# EAGLE design giraffe-cjd (EAGLE 9.1.0)
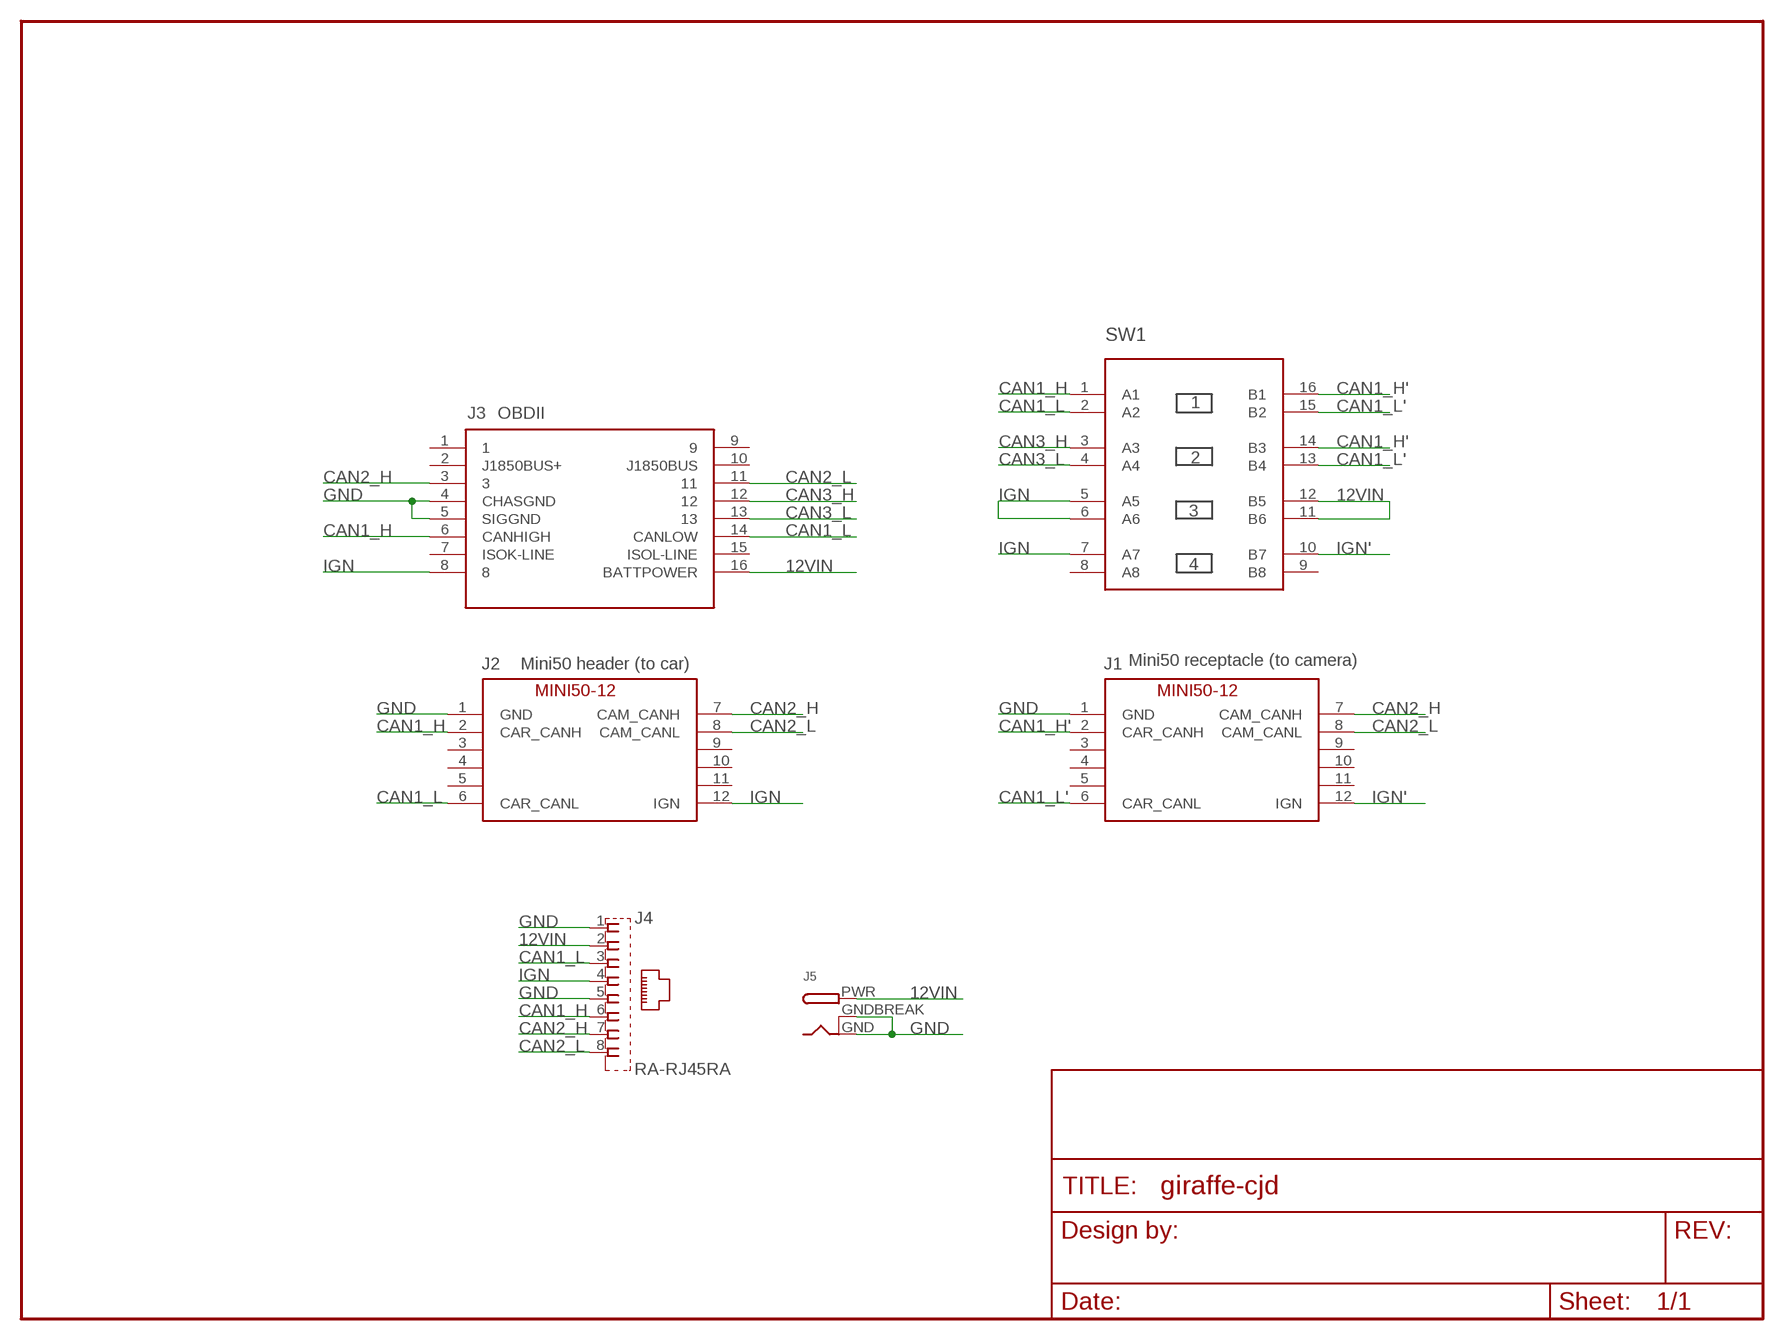
[diagram p0: schematic, sheet 1]

## Parts
FRAME1  FRAME-LETTERNO_PACKAGE  [DUMMY]
J1  MINI50MINI50-12-VERT  [MINI50-12]
J2  MINI50MINI50-12-VERT  [MINI50-12]
J3  OBDII-FEMALE-CUT  [OBDII-FEMALE-MIDCUT]
J4  RA-RJ45RA  [RA-RJ45]
J5  DCBARRELPTH  [DCJACK_2MM_PTH]
SW1  4XDPSTSMT  [4-DPST]

## Nets
12VIN: J3.16(BATTPOWER) J4.2 J5.PWR SW1.11(B6) SW1.12(B5)
CAN1_H: J2.2(CAR_CANH) J3.6(CANHIGH) J4.6 SW1.1(A1)
CAN1_H': J1.2(CAR_CANH) SW1.14(B3) SW1.16(B1)
CAN1_L: J2.6(CAR_CANL) J3.14(CANLOW) J4.3 SW1.2(A2)
CAN1_L': J1.6(CAR_CANL) SW1.13(B4) SW1.15(B2)
CAN2_H: J1.7(CAM_CANH) J2.7(CAM_CANH) J3.3 J4.7
CAN2_L: J1.8(CAM_CANL) J2.8(CAM_CANL) J3.11 J4.8
CAN3_H: J3.12 SW1.3(A3)
CAN3_L: J3.13 SW1.4(A4)
GND: J1.1(GND) J2.1(GND) J3.4(CHASGND) J3.5(SIGGND) J4.1 J4.5 J5.GND J5.GNDBREAK
IGN: J2.12(IGN) J3.8 J4.4 SW1.5(A5) SW1.6(A6) SW1.7(A7)
IGN': J1.12(IGN) SW1.10(B7)
Unconnected: J1.3 J1.4 J1.5 J1.9 J1.10 J1.11 J2.3 J2.4 J2.5 J2.9 J2.10 J2.11 J3.1 J3.2(J1850BUS+) J3.7(ISOK-LINE) J3.9 J3.10(J1850BUS) J3.15(ISOL-LINE) SW1.8(A8) SW1.9(B8)

## Notes on the sheet
- OBDII
- Mini50 header (to car) | Mini50 receptacle (to camera)

## Library data of the parts
FRAME1 = SparkFun-Aesthetics:FRAME-LETTER: Schematic Frame Standard 8.5x11 US Letter frame; DESIGNER: adhintz; VERSION: v01
J1 J2 = comma2.ai:MINI50: mini50 12 vertical header
J3 = comma.ai:OBDII-FEMALE
J4 = comma.ai:RA-RJ45
J5 = adafruit:DCBARREL: 2.0mm DC Barrel Jack DCJACK_2MM_PTH - Through Hole Jack (4UConnector: 05537)
SW1 = comma.ai:4XDPST

## Board
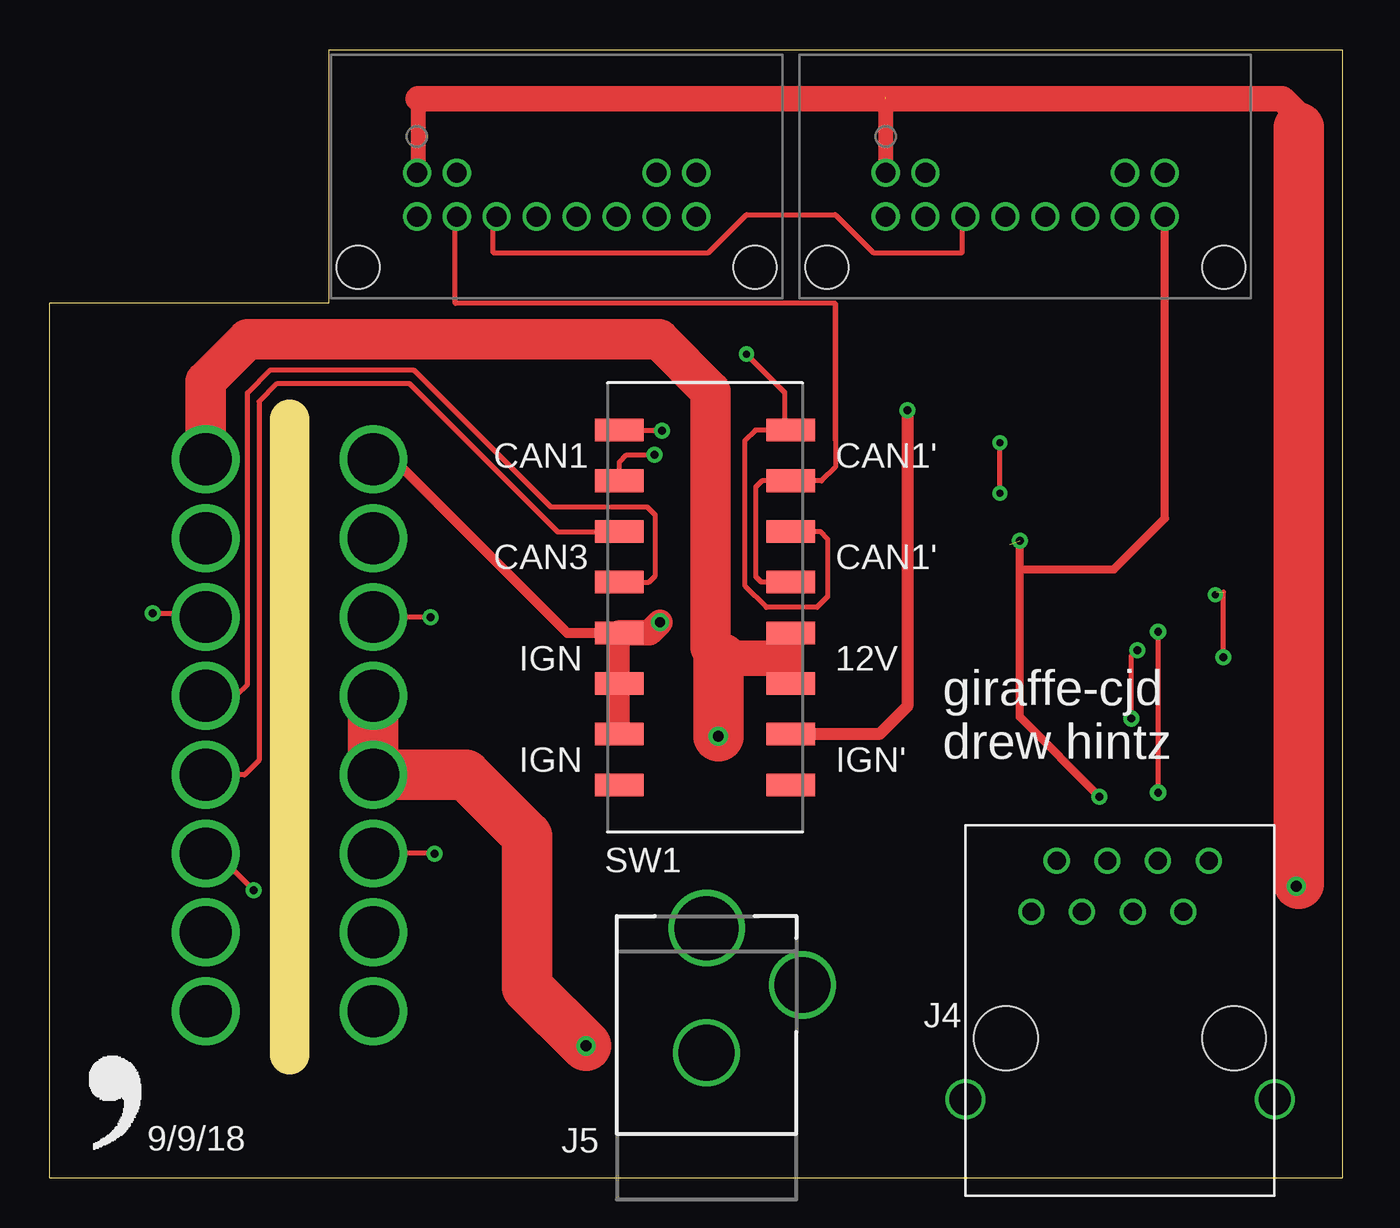
[diagram p1: board, top side]
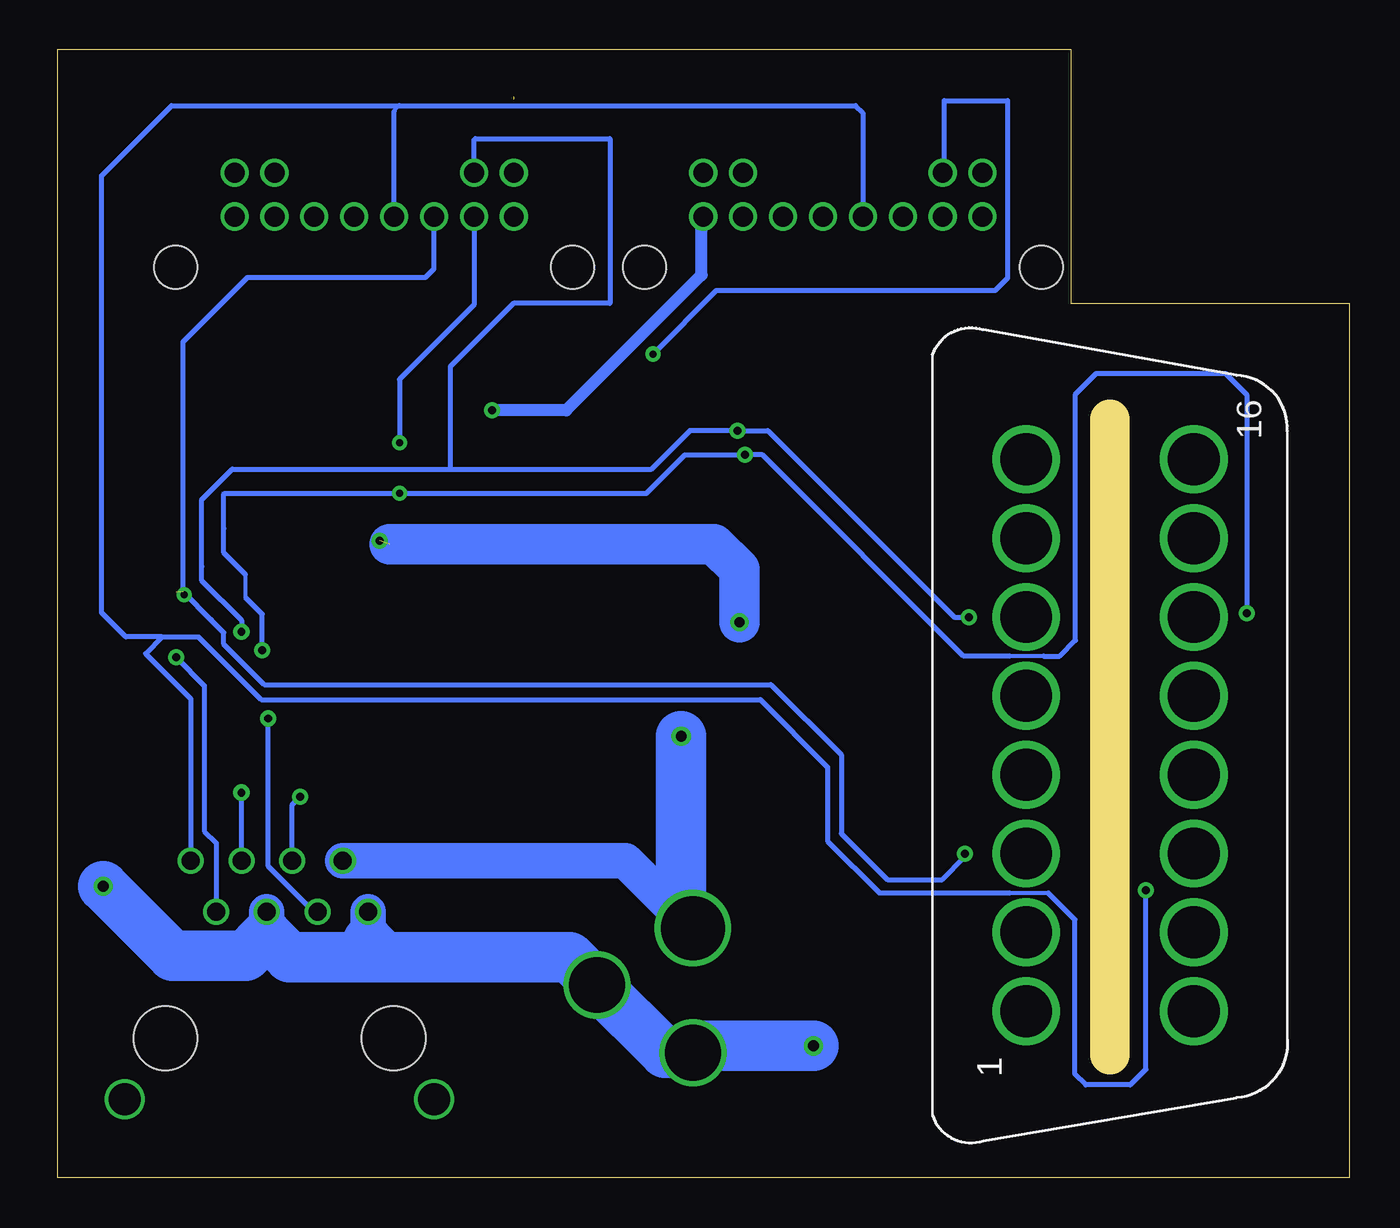
[diagram p2: board, bottom side, seen from below]

Size 64.77 x 56.52 mm. Coordinates in mm from the lower left corner, seen from the top.
Outline: 12.01,6.17 12.01,38
Outline: 13.97,56.52 64.77,56.52 64.77,0 0,0 0,43.81 13.97,43.81 13.97,56.52
Copper layers (1*16): Top 0.035mm / dielectric 1.5mm / Bottom 0.035mm
Design rules "default *": minimum track width 6mil, minimum drill 10mil, track to track 6mil, track to pad 6mil, pad to pad 6mil, via to via 6mil, smd to smd 6mil, copper to edge 15mil, drill to drill 10mil, minimum pad ring 8mil, minimum via ring 8mil, stop-mask expansion 4mil, vias tented up to drill 0mil, thermal gap 10mil

### Footprints (pad centres in the part's own frame; a part is rotated, then mirrored left to right if it is on the bottom)
MINI50-12 = drill 1: 1 -7,0.2; 2 -5,0.2; 3 5,0.2; 4 7,0.2; 5 -7,-2; 6 -5,-2; 7 -3,-2; 8 -1,-2; 9 1,-2; 10 3,-2; 11 5,-2; 12 7,-2 | hole 2.16: -9.95,-4.55; 9.95,-4.55
OBDII-FEMALE-MIDCUT = drill 2.6 pad 3.4: 1 13.825,-4.2; 2 9.875,-4.2; 3 5.925,-4.2; 4 1.975,-4.2; 5 -1.975,-4.2; 6 -5.925,-4.2; 7 -9.875,-4.2; 8 -13.825,-4.2; 9 13.825,4.2; 10 9.875,4.2; 11 5.925,4.2; 12 1.975,4.2; 13 -1.975,4.2; 14 -5.925,4.2; 15 -9.875,4.2; 16 -13.825,4.2
RA-RJ45 = drill 0.9: 1 -4.445,6.35; 2 -3.175,8.89; 3 -1.905,6.35; 4 -0.635,8.89; 5 0.635,6.35; 6 1.905,8.89; 7 3.175,6.35; 8 4.445,8.89 | drill 1.6: P$1 -7.75,-3.05; P$2 7.75,-3.05 | hole 3.2: -5.715,0; 5.715,0
DCJACK_2MM_PTH = drill 2.8: GND 0,7.35; GNDBREAK 4.8,10.75 | drill 3.2: PWR 0,13.6
4-DPST = smd 1.13 x 2.44: 1 -8.89,-4.3; 2 -6.35,-4.3; 3 -3.81,-4.3; 4 -1.27,-4.3; 5 1.27,-4.3; 6 3.81,-4.3; 7 6.35,-4.3; 8 8.89,-4.3; 9 8.89,4.3; 10 6.35,4.3; 11 3.81,4.3; 12 1.27,4.3; 13 -1.27,4.3; 14 -3.81,4.3; 15 -6.35,4.3; 16 -8.89,4.3

### Placement (x,y rotation side)
FRAME1  -8.89,-10.79 0 top  (outside the outline)
J1  25.4,50.16 0 top
J2  48.9,50.16 0 top
J3  12.01,22.17 270 bottom
J4  53.64,6.99 0 top
J5  32.92,-1.09 0 top
SW1  32.84,28.57 270 top
U$1  [LOGO]  1.3,1.12 0 top

### Tracks (layer width: path | path; a pad name or v marks a point on that pad's centre or on a via)
12VIN  (via drill 0.55)
  Top 0.61: 35.51,26.04 36.78,27.3 SW1.12
  Top 1.016: SW1.12 SW1.11
  Top 1.778: 36.5,26.11 36.42,26.04 35.51,26.04 33.67,26.04
  Top 2.032: J3.16 7.81,39.92 9.91,42.01 30.53,42.01 33.12,39.42 33.12,26.58 33.67,26.04
  Top 2.54: v33.5,22.12 33.5,25.87 33.67,26.04
  Bottom 1.778: J5.PWR 36.29,15.88 J4.2
  Bottom 2.54: v33.5,22.12 33.5,13.09 J5.PWR
CAN1_H  (via drill 0.4)
  Top 0.254: 28.55,37.46 SW1.1 30.66,37.47 v30.68,37.44 | v19.07,28.09 J3.6 | v55.55,27.36 v55.55,19.3
  Bottom 0.152: 43.9,51.99 43.81,52.07
  Bottom 0.254: v19.07,28.09 19.81,28.09 29.16,37.44 v30.68,37.44 33.07,37.44 35,35.51 45.09,35.51 | J4.6 v55.55,19.3 | 45.09,35.51 56.01,35.51 57.53,33.98 57.53,30.63 57.53,29.92 55.55,27.94 v55.55,27.36 | J2.2 43.9,51.99 | 43.81,52.07 37.08,52.07 37.08,43.81 41.91,43.81 45.09,40.64 45.09,35.51
CAN1_H'  (via drill 0.35)
  Top 0.254: SW1.14 38.61,32.38 38.99,32 38.99,29.11 38.46,28.57 35.92,28.57 34.85,29.64 34.85,36.96 35.36,37.47 36.83,37.47 | 36.83,37.47 SW1.16 37.17,37.49 37.9,37.49 | v34.92,41.27 36.83,39.37 36.83,37.47
  Bottom 0.152: J1.2 20.32,50.45
  Bottom 0.254: 20.32,50.45 20.32,53.98 17.14,53.98 17.14,45.09 17.78,44.45 31.75,44.45 v34.92,41.27
CAN1_L  (via drill 0.35, 0.4)
  Top 0.254: v5.16,28.3 7.62,28.3 J3.14 | 29.01,34.92 SW1.2 28.54,35.86 28.91,36.22 v30.3,36.22 | v54.2,23.01 54.2,26.14 v54.51,26.44 | v47.62,34.29 v47.62,36.83
  Bottom 0.203: 15.34,26.14 17.05,26.14 | 55.34,29.07 55.34,30.22 55.35,30.23
  Bottom 0.254: 15.34,26.14 14.53,26.14 13.74,26.92 13.74,39.27 12.7,40.31 6.22,40.31 5.16,39.24 v5.16,28.3 | 17.05,26.14 19.36,26.14 29.44,36.22 v30.3,36.22 33.33,36.22 35.26,34.29 v47.62,34.29 56.41,34.29 56.44,34.27 56.44,32.54 56.44,31.32 55.35,30.23 | J4.3 51.92,13.34 54.2,15.62 v54.2,23.01 | v54.51,26.44 54.51,28.24 55.34,29.07 | J2.6 43.9,43.73 47.62,40.01 v47.62,36.83
CAN1_L'
  Top 0.152: 20.32,48.09 J1.6
  Top 0.254: SW1.15 37.92,34.92 | SW1.13 35.66,29.84 35.38,30.12 35.38,34.62 35.69,34.92 SW1.15 | SW1.15 | SW1.15 | 39.37,43.81 39.37,35.61 38.68,34.92 SW1.15 | 39.37,36.96 39.37,43.81 | 39.37,43.81 20.32,43.81 20.32,48.09
CAN2_H  (via drill 0.4)  (1 unrouted)
  Top 0.152: J2.7 45.72,47.99 | 22.23,47.99 J1.7
  Top 0.254: v19.28,16.23 19.26,16.25 J3.3 | v58.83,26.09 58.83,29.35 | 45.72,47.99 45.72,46.35 41.27,46.35 39.37,48.26 34.92,48.26 33.02,46.35 22.23,46.35 22.23,47.99
  Bottom 0.254: 57.06,27.94 58.47,29.35 58.47,41.88 55.24,45.11 46.33,45.11 45.9,45.55 J2.7 | 57.06,27.96 57.06,27.94 | v58.83,26.09 57.4,24.66 57.4,17.37 56.81,16.79 J4.7 | v19.28,16.23 19.28,16.08 20.42,14.94 23.16,14.94 25.48,17.25 25.48,21.18 29.01,24.71 54.41,24.71 56.44,26.74 56.44,27.32 57.06,27.94
CAN2_L  (via drill 0.4)
  Top 0.254: v10.21,14.4 8.36,16.25 J3.11
  Bottom 0.152: 47.9,53.45 47.62,53.72 | 24.77,53.72
  Bottom 0.203: 17.04,14.28 15.11,14.28
  Bottom 0.254: 59.51,27.1 61.34,27.1 62.56,28.32 62.56,50.22 59.05,53.72 47.62,53.72 24.77,53.72 24.4,53.36 J1.8 | 59.51,27.1 57.71,27.1 54.56,23.95 29.54,23.95 26.16,20.57 26.16,16.87 23.57,14.28 17.04,14.28 | 59.51,27.1 60.35,26.26 58.09,24 J4.8 | 15.11,14.28 13.77,12.93 13.77,5.18 13.23,4.65 11,4.65 10.21,5.44 v10.21,14.4 | J2.8 47.9,53.45
CAN3_H
  Top 0.254: J3.12 9.75,20.19 10.49,20.93 10.49,38.89 11.4,39.8 18.01,39.8 25.45,32.36 28.12,32.36 28.14,32.38 | 28.14,32.38 SW1.3 | 28.14,32.38 27.86,32.38
CAN3_L
  Top 0.254: SW1.4 30.02,29.84 30.35,30.18 30.35,33.2 29.95,33.6 25.12,33.6 18.26,40.46 11.02,40.46 9.91,39.34 9.91,24.71 9.35,24.16 J3.13
GND  (via drill 0.55)  (1 unrouted)
  Top 0.152: 41.9,54.17 41.79,54.07 | 18.45,50.41 J1.1 | 41.91,54.07 41.9,54.05
  Top 0.762: 18.45,54.07 18.45,50.41 | 41.9,54.05 J2.1
  Top 1.27: 41.91,54.07 61.78,54.07 62.61,53.24 62.61,52.6 | 41.79,54.07 18.45,54.07
  Top 1.524: 62.61,32.38 62.47,32.38
  Top 1.778: 62.61,36.58 62.61,37.47 | 62.61,33.27 62.61,32.38
  Top 2.032: 16.21,22.21 J3.4 | v62.48,14.61 62.61,14.73
  Top 2.54: 62.61,14.73 62.61,32.38 62.61,34.92 62.61,37.47 62.61,52.6 | J3.5 J3.4 20.85,20.2 23.93,17.12 23.93,9.55 v26.87,6.6
  Bottom 1.778: 49.2,11.89 J4.1 | 55.35,11.12 54.27,12.2 J4.5
  Bottom 2.54: v62.48,14.61 59,11.12 55.35,11.12 54.28,12.19 53.14,11.05 48.36,11.05 | v26.87,6.6 32.57,6.6 J5.GND 34.32,6.26 J5.GNDBREAK 39.11,11.05 48.36,11.05 | 48.36,11.05 49.2,11.89
IGN  (via drill 0.4, 0.5)  (1 unrouted)
  Top 0.406: 48.62,30.48 48.62,23.09 v52.6,19.1 | 48.62,30.48 v48.62,31.93 | 48.62,30.48 53.34,30.48 55.9,33.03 J2.12
  Top 0.508: 16.23,36.02 J3.8 17.24,36 25.93,27.3 SW1.5
  Top 0.61: SW1.7 28.52,22.25
  Top 1.016: SW1.7 SW1.6 SW1.5
  Top 1.27: SW1.5 30.05,27.3 v30.58,27.84
  Bottom 0.254: J4.4 53.01,18.7 v52.6,19.1
  Bottom 0.406: 48.62,32.05 v48.62,31.93
  Bottom 2.032: 48.12,31.75 35.56,31.75 33.66,31.75 | 33.66,31.75 33.02,31.75 | 33.66,31.75 31.85,31.75 30.58,30.48 v30.58,27.84
IGN'  (via drill 0.4)
  Top 0.61: SW1.10 41.58,22.23 42.98,23.62 v42.98,38.46
  Bottom 0.152: 32.49,48.08 J1.12
  Bottom 0.61: v42.98,38.46 39.27,38.46 32.51,45.21 32.49,45.24 32.49,48.08
N$1  (via drill 0.35)
  other vias: 58.42,29.21

### Text on the board
tPlace: CAN1 | CAN1' | CAN3 | CAN1' | IGN | 12V | giraffe-cjd / drew hintz | IGN | IGN' | 9/9/18